# Altium schematic sheet Outputs.SchDoc
size A4 portrait; SheetNumber: 4; SheetTotal: 3
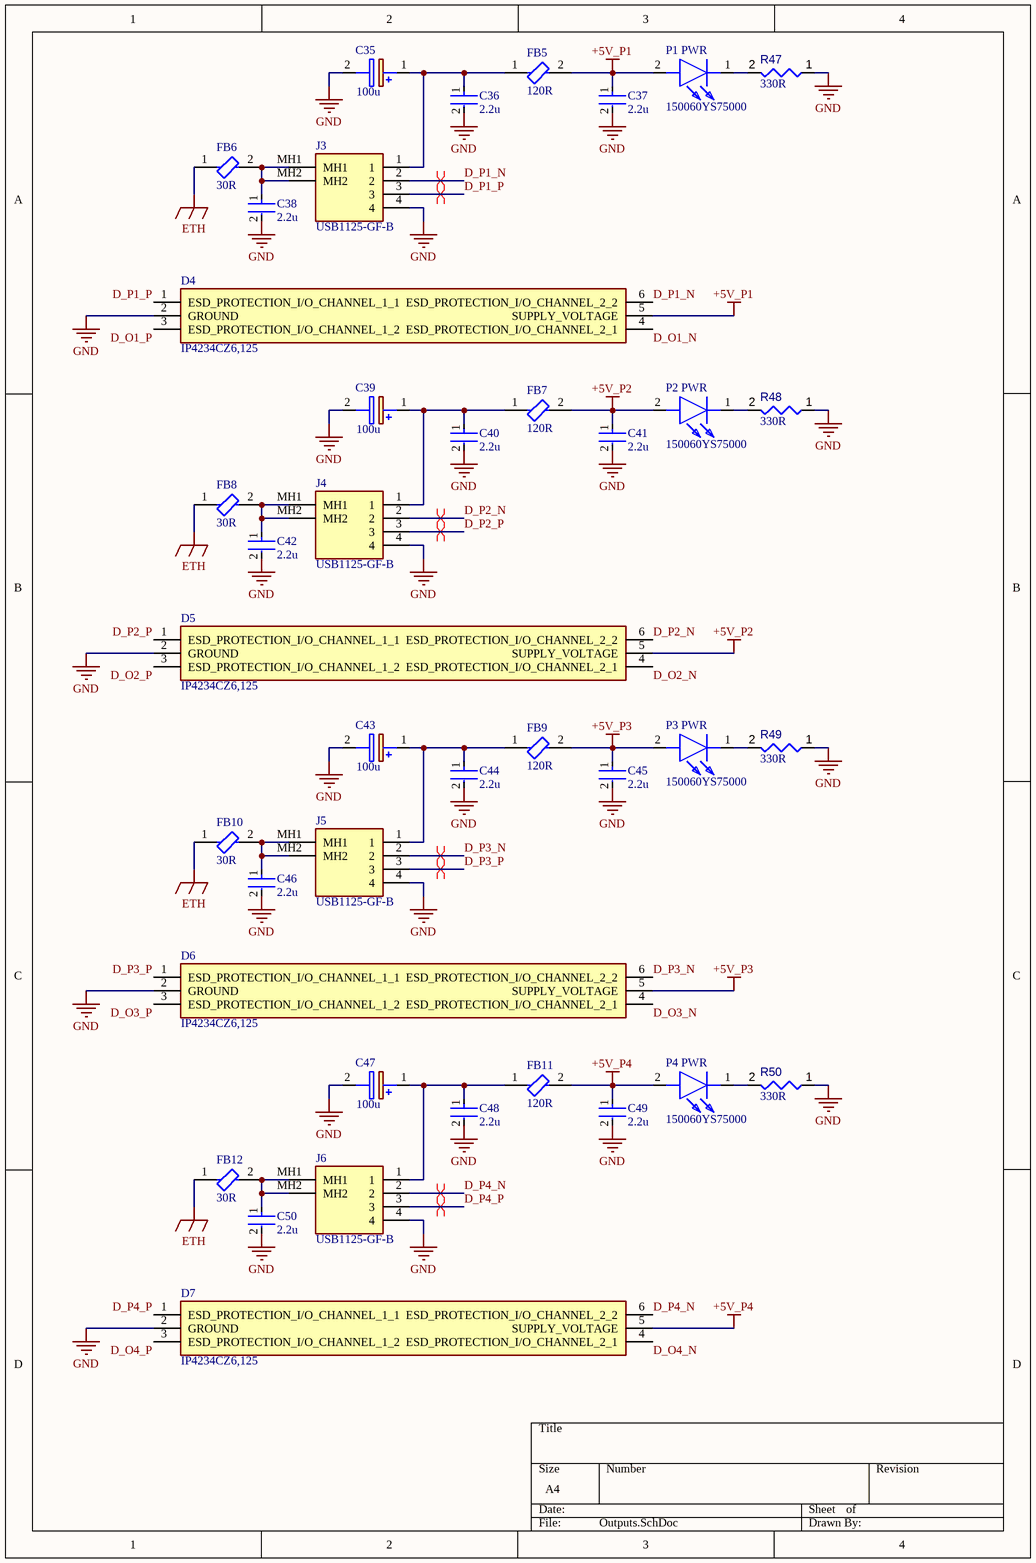
[diagram p0: Outputs.SchDoc]

## Parts
C35  value 100u  [CAPPM7343X310N]  (hidden comment: 293D107X0016D2TE3)
C36  Capacitance: 2.2u  [0603-C]  (hidden comment: 0603 CAP)
C37  Capacitance: 2.2u  [0603-C]  (hidden comment: 0603 CAP)
C38  Capacitance: 2.2u  [0603-C]  (hidden comment: 0603 CAP)
C39  value 100u  [CAPPM7343X310N]  (hidden comment: 293D107X0016D2TE3)
C40  Capacitance: 2.2u  [0603-C]  (hidden comment: 0603 CAP)
C41  Capacitance: 2.2u  [0603-C]  (hidden comment: 0603 CAP)
C42  Capacitance: 2.2u  [0603-C]  (hidden comment: 0603 CAP)
C43  value 100u  [CAPPM7343X310N]  (hidden comment: 293D107X0016D2TE3)
C44  Capacitance: 2.2u  [0603-C]  (hidden comment: 0603 CAP)
C45  Capacitance: 2.2u  [0603-C]  (hidden comment: 0603 CAP)
C46  Capacitance: 2.2u  [0603-C]  (hidden comment: 0603 CAP)
C47  value 100u  [CAPPM7343X310N]  (hidden comment: 293D107X0016D2TE3)
C48  Capacitance: 2.2u  [0603-C]  (hidden comment: 0603 CAP)
C49  Capacitance: 2.2u  [0603-C]  (hidden comment: 0603 CAP)
C50  Capacitance: 2.2u  [0603-C]  (hidden comment: 0603 CAP)
D4  IP4234CZ6,125  [SOP95P275X110-6N]
D5  IP4234CZ6,125  [SOP95P275X110-6N]
D6  IP4234CZ6,125  [SOP95P275X110-6N]
D7  IP4234CZ6,125  [SOP95P275X110-6N]
FB5  120R  [FP-ILHB-0805-IPC_C]
FB6  30R  [FP-BLM18-0_15-t0_6-d1_2-MFG]
FB7  120R  [FP-ILHB-0805-IPC_C]
FB8  30R  [FP-BLM18-0_15-t0_6-d1_2-MFG]
FB9  120R  [FP-ILHB-0805-IPC_C]
FB10  30R  [FP-BLM18-0_15-t0_6-d1_2-MFG]
FB11  120R  [FP-ILHB-0805-IPC_C]
FB12  30R  [FP-BLM18-0_15-t0_6-d1_2-MFG]
J3  USB1125-GF-B  [USB1125GFB]
J4  USB1125-GF-B  [USB1125GFB]
J5  USB1125-GF-B  [USB1125GFB]
J6  USB1125-GF-B  [USB1125GFB]
P1_PWR  150060YS75000  [LEDC1608X80N]
P2_PWR  150060YS75000  [LEDC1608X80N]
P3_PWR  150060YS75000  [LEDC1608X80N]
P4_PWR  150060YS75000  [LEDC1608X80N]
R47  value 330R  [0603-R]  (hidden comment: 0603 Resistor)
R48  value 330R  [0603-R]  (hidden comment: 0603 Resistor)
R49  value 330R  [0603-R]  (hidden comment: 0603 Resistor)
R50  value 330R  [0603-R]  (hidden comment: 0603 Resistor)

## Nets
+5V_P1: C37.1 D4.5(SUPPLY_VOLTAGE) FB5.2 P1_PWR.2(A)
+5V_P2: C41.1 D5.5(SUPPLY_VOLTAGE) FB7.2 P2_PWR.2(A)
+5V_P3: C45.1 D6.5(SUPPLY_VOLTAGE) FB9.2 P3_PWR.2(A)
+5V_P4: C49.1 D7.5(SUPPLY_VOLTAGE) FB11.2 P4_PWR.2(A)
ETH: FB6.1 FB8.1 FB10.1 FB12.1
GND: C35.2(-) C36.2 C37.2 C38.2 C39.2(-) C40.2 C41.2 C42.2 C43.2(-) C44.2 C45.2 C46.2 C47.2(-) C48.2 C49.2 C50.2 D4.2(GROUND) D5.2(GROUND) D6.2(GROUND) D7.2(GROUND) J3.4 J4.4 J5.4 J6.4 R47.1 R48.1 R49.1 R50.1
D_O1_N: D4.4(ESD_PROTECTION_I/O_CHANNEL_2_1)
D_O1_P: D4.3(ESD_PROTECTION_I/O_CHANNEL_1_2)
D_O2_N: D5.4(ESD_PROTECTION_I/O_CHANNEL_2_1)
D_O2_P: D5.3(ESD_PROTECTION_I/O_CHANNEL_1_2)
D_O3_N: D6.4(ESD_PROTECTION_I/O_CHANNEL_2_1)
D_O3_P: D6.3(ESD_PROTECTION_I/O_CHANNEL_1_2)
D_O4_N: D7.4(ESD_PROTECTION_I/O_CHANNEL_2_1)
D_O4_P: D7.3(ESD_PROTECTION_I/O_CHANNEL_1_2)
D_P1_N: D4.6(ESD_PROTECTION_I/O_CHANNEL_2_2) J3.2
D_P1_P: D4.1(ESD_PROTECTION_I/O_CHANNEL_1_1) J3.3
D_P2_N: D5.6(ESD_PROTECTION_I/O_CHANNEL_2_2) J4.2
D_P2_P: D5.1(ESD_PROTECTION_I/O_CHANNEL_1_1) J4.3
D_P3_N: D6.6(ESD_PROTECTION_I/O_CHANNEL_2_2) J5.2
D_P3_P: D6.1(ESD_PROTECTION_I/O_CHANNEL_1_1) J5.3
D_P4_N: D7.6(ESD_PROTECTION_I/O_CHANNEL_2_2) J6.2
D_P4_P: D7.1(ESD_PROTECTION_I/O_CHANNEL_1_1) J6.3
NetC35_1: C35.1(+) C36.1 FB5.1 J3.1
NetC38_1: C38.1 FB6.2 J3.MH1 J3.MH2
NetC39_1: C39.1(+) C40.1 FB7.1 J4.1
NetC42_1: C42.1 FB8.2 J4.MH1 J4.MH2
NetC43_1: C43.1(+) C44.1 FB9.1 J5.1
NetC46_1: C46.1 FB10.2 J5.MH1 J5.MH2
NetC47_1: C47.1(+) C48.1 FB11.1 J6.1
NetC50_1: C50.1 FB12.2 J6.MH1 J6.MH2
NetP1_PWR_1: P1_PWR.1(K) R47.2
NetP2_PWR_1: P2_PWR.1(K) R48.2
NetP3_PWR_1: P3_PWR.1(K) R49.2
NetP4_PWR_1: P4_PWR.1(K) R50.2

## Layout directives
differential pair: D_P1_N, D_P1_P, D_P2_N, D_P2_P, D_P3_N, D_P3_P, D_P4_N, D_P4_P

## Library data of the parts
C35 C39 C43 C47 = 293D107X0016D2TE3: Capacitor Polarised; Manufacturer_Name: Vishay; Datasheet Link: http://www.vishay.com/doc?40002; Height: 3.1mm; Manufacturer_Part_Number: 293D107X0016D2TE3; Mouser Part Number: 74-293D107X0016D2TE3; Mouser Price/Stock: https://www.mouser.com/Search/Refine.aspx?Keyword=74-293D107X0016D2TE3; Arrow Part Number: 293D107X0016D2TE3; Arrow Price/Stock: https://www.arrow.com/en/products/293d107x0016d2te3/vishay
C36-C38 C40-C42 C44-C46 C48-C50 = CMP-2006-02792-2: Manufacturer: Murata; Manufacturer Part Number: GRM188R60J106ME47D; Voltage Rating (DC): 6.3V; Dielectric: X5R; Material: Ceramic; Tolerance: 20%; Packaging: Tape and Reel; Width: 0.031inch; Termination: SMD/SMT; Package Quantity: 4000; Voltage Rating: 6.3V; Case/Package: 0603; Min Operating Temperature: -55°C; Voltage: 6.3V; Length: 1.6mm; Thickness: 0.035inch; Lead Free: Lead Free; Depth: 0.8mm; Case Code (Imperial): 0603; Max Operating Temperature: 85°C; Height: 0.8mm; Mount: Surface Mount; REACH SVHC: No SVHC; Radiation Hardening: No; Case Code (Metric): 1608
D4-D7 = IP4234CZ6,125: Diode; Manufacturer_Name: Nexperia; Datasheet Link: https://assets.nexperia.com/documents/data-sheet/IP4234CZ6.pdf; Height: 1.1mm; Manufacturer_Part_Number: IP4234CZ6,125; Mouser Part Number: 771-IP4234CZ6125; Mouser Price/Stock: https://www.mouser.co.uk/ProductDetail/Nexperia/IP4234CZ6125?qs=sSXnapcmqSskfgXn%2F9aKzA%3D%3D; Arrow Part Number: IP4234CZ6,125; Arrow Price/Stock: https://www.arrow.com/en/products/ip4234cz6125/nexperia?region=nac
FB5 FB7 FB9 FB11 = CMP-02428-000001-1: FERRITE BEAD 600 OHM 0805 1LN; Manufacturer: Vishay; Manufacturer Part Number: ILHB0805ER601V; Tolerance: 25%; Shielding: true; Test Frequency: 100MHz; Impedance At Frequency: 600Ω @ 100MHz; Series Resistance: 0.1Ω; Rms Current: 2000mA; ComponentLink2URL: http://www.vishay.com/docs/34102/ilhb.pdf; Octopart: https://octopart.com/ilhb0805er601v-vishay-39650184; Automotive: No; Height: 1.1mm; Mouser Description: Ferrite Beads Multi-Layer High Current 600Ohm 25% 100MHz 2A 100mOhm DCR 0805 T/R; ComponentLink2Description: Datasheet; Device Class L2: EMI / RFI Components; Lead Free: Yes; Ipc Land Pattern Name: CAPC200125X90; Package: ILHB-0805; Device Class L1: Passive Components; Digikey Description: FERRITE BEAD 600 OHM 0805 1LN; Category: FBead; Temperature Range High: +125°C; Temperature: -55°C to +125°C; RoHS: TRUE; Temperature Range Low: -55°C; Device Class L3: Ferrite Beads and Chips
FB6 FB8 FB10 FB12 = CMP-0686-00540-4: Chip Ferrite Bead Array, 0603, 30Ω @ 100MHz, 25%, 0.01Ω, 5A; Material: Steel; Number of Circuits: 1; DC Resistance (DCR): 10mR; Max Operating Temperature: 125°C; Max DC Current: 5A; Lead Free: Lead Free; Case Code (Imperial): 0603; RoHS Compliant: Yes; DC Current: 5A; Series: BLM18K; Number of Pins: 2; REACH SVHC: No SVHC; Case/Package: 0603; Military Standard: Not; Height: 0.8mm; Depth: 0.8mm; Core Material: Ferrite; Length: 1.6mm; Weight: 7.1E-05oz; Case Code (Metric): 1608; Impedance: 30R; Termination: SMD/SMT; Tolerance: 25%; Number of Lines: 1; Radiation Hardening: No; Packaging: Tape and Reel; Test Frequency: 100MHz; Current Rating: 5A; Package Quantity: 1; Width: 0.8mm; Max Current Rating: 5A; Min Operating Temperature: -55°C
J3-J6 = USB1125-GF-B: Connector; Manufacturer_Name: GCT (GLOBAL CONNECTOR TECHNOLOGY); Datasheet Link: https://gct.co/connector/usb1125; Height: 6.63mm; Manufacturer_Part_Number: USB1125-GF-B; Mouser Part Number: 640-USB1125-GF-B; Mouser Price/Stock: https://www.mouser.co.uk/ProductDetail/GCT/USB1125-GF-B?qs=KUoIvG%2F9IlbMrLtAEIp0gA%3D%3D
P1_PWR P2_PWR P3_PWR P4_PWR = 150060YS75000: LED; Manufacturer_Name: Wurth Elektronik; Datasheet Link: http://uk.rs-online.com/web/p/products/8154219; Height: 0.8mm; Manufacturer_Part_Number: 150060YS75000; Mouser Part Number: 710-150060YS75000; Mouser Price/Stock: https://www.mouser.co.uk/ProductDetail/Wurth-Elektronik/150060YS75000?qs=LlUlMxKIyB0nKmwefHgtZw%3D%3D
R47-R50 = CMP-009-00014-5: Manufacturer: Yageo; Manufacturer Part Number: RC0603FR-071KL; Manufacturer: Panasonic; Manufacturer Part Number: ERJ3EKF1001V; Manufacturer Part Number: RC0603FR-131KL; Voltage Rating: 50V; Power: 100mW; Tolerance: 1%; Mounting Technology: SM; Pins: 2; Case/Package: 0603; Min Operating Temperature: -55°C; RoHS Compliant: True; Max Operating Temperature: 155°C; Component Type: Resistors